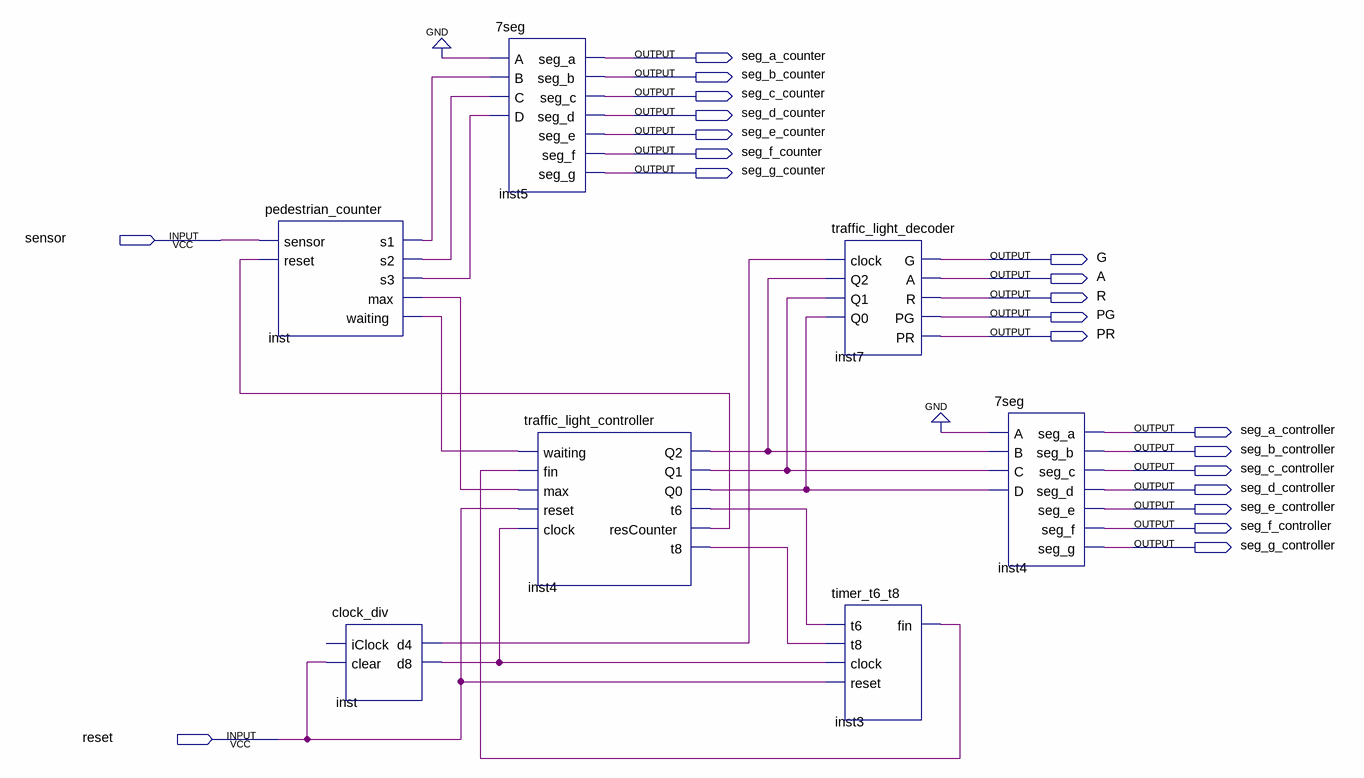
[diagram p0: schematic sheet]
// Quartus schematic traffic_light.bdf as structural Verilog: 7 symbols, 21 pins
module traffic_light (
  input  sensor,
  input  reset,
  output seg_a_counter,
  output seg_b_counter,
  output seg_c_counter,
  output seg_d_counter,
  output seg_e_counter,
  output seg_f_counter,
  output seg_g_counter,
  output G,
  output A,
  output R,
  output PG,
  output PR,
  output seg_a_controller,
  output seg_b_controller,
  output seg_c_controller,
  output seg_d_controller,
  output seg_e_controller,
  output seg_f_controller,
  output seg_g_controller
);

  wire inst3_fin, inst4_q0, inst4_q1, inst4_q2, inst4_rescounter, inst4_t6, inst4_t8, inst_d4, inst_d8,
       inst_max, inst_s1, inst_s2, inst_s3, inst_waiting;

  pedestrian_counter inst (
    .sensor(sensor), .reset(inst4_rescounter), .s1(inst_s1), .s2(inst_s2), .s3(inst_s3), .max(inst_max),
    .waiting(inst_waiting));
  clock_div inst_dup2 (.clear(reset), .d4(inst_d4), .d8(inst_d8));  // open: iClock
  \7seg  inst5 (
    .A(1'b0), .B(inst_s1), .C(inst_s2), .D(inst_s3), .seg_a(seg_a_counter), .seg_b(seg_b_counter),
    .seg_c(seg_c_counter), .seg_d(seg_d_counter), .seg_e(seg_e_counter), .seg_f(seg_f_counter),
    .seg_g(seg_g_counter));
  traffic_light_controller inst4 (
    .waiting(inst_waiting), .fin(inst3_fin), .max(inst_max), .reset(reset), .clock(inst_d8), .Q2(inst4_q2),
    .Q1(inst4_q1), .Q0(inst4_q0), .t6(inst4_t6), .resCounter(inst4_rescounter), .t8(inst4_t8));
  traffic_light_decoder inst7 (
    .clock(inst_d4), .Q2(inst4_q2), .Q1(inst4_q1), .Q0(inst4_q0), .G(G), .A(A), .R(R), .PG(PG), .PR(PR));
  timer_t6_t8 inst3 (.t6(inst4_t6), .t8(inst4_t8), .clock(inst_d8), .reset(reset), .fin(inst3_fin));
  \7seg  inst4_dup2 (
    .A(1'b0), .B(inst4_q2), .C(inst4_q1), .D(inst4_q0), .seg_a(seg_a_controller), .seg_b(seg_b_controller),
    .seg_c(seg_c_controller), .seg_d(seg_d_controller), .seg_e(seg_e_controller), .seg_f(seg_f_controller),
    .seg_g(seg_g_controller));
endmodule
